# EAGLE design PCB-B4LinkMicroS (EAGLE 7.5.0)
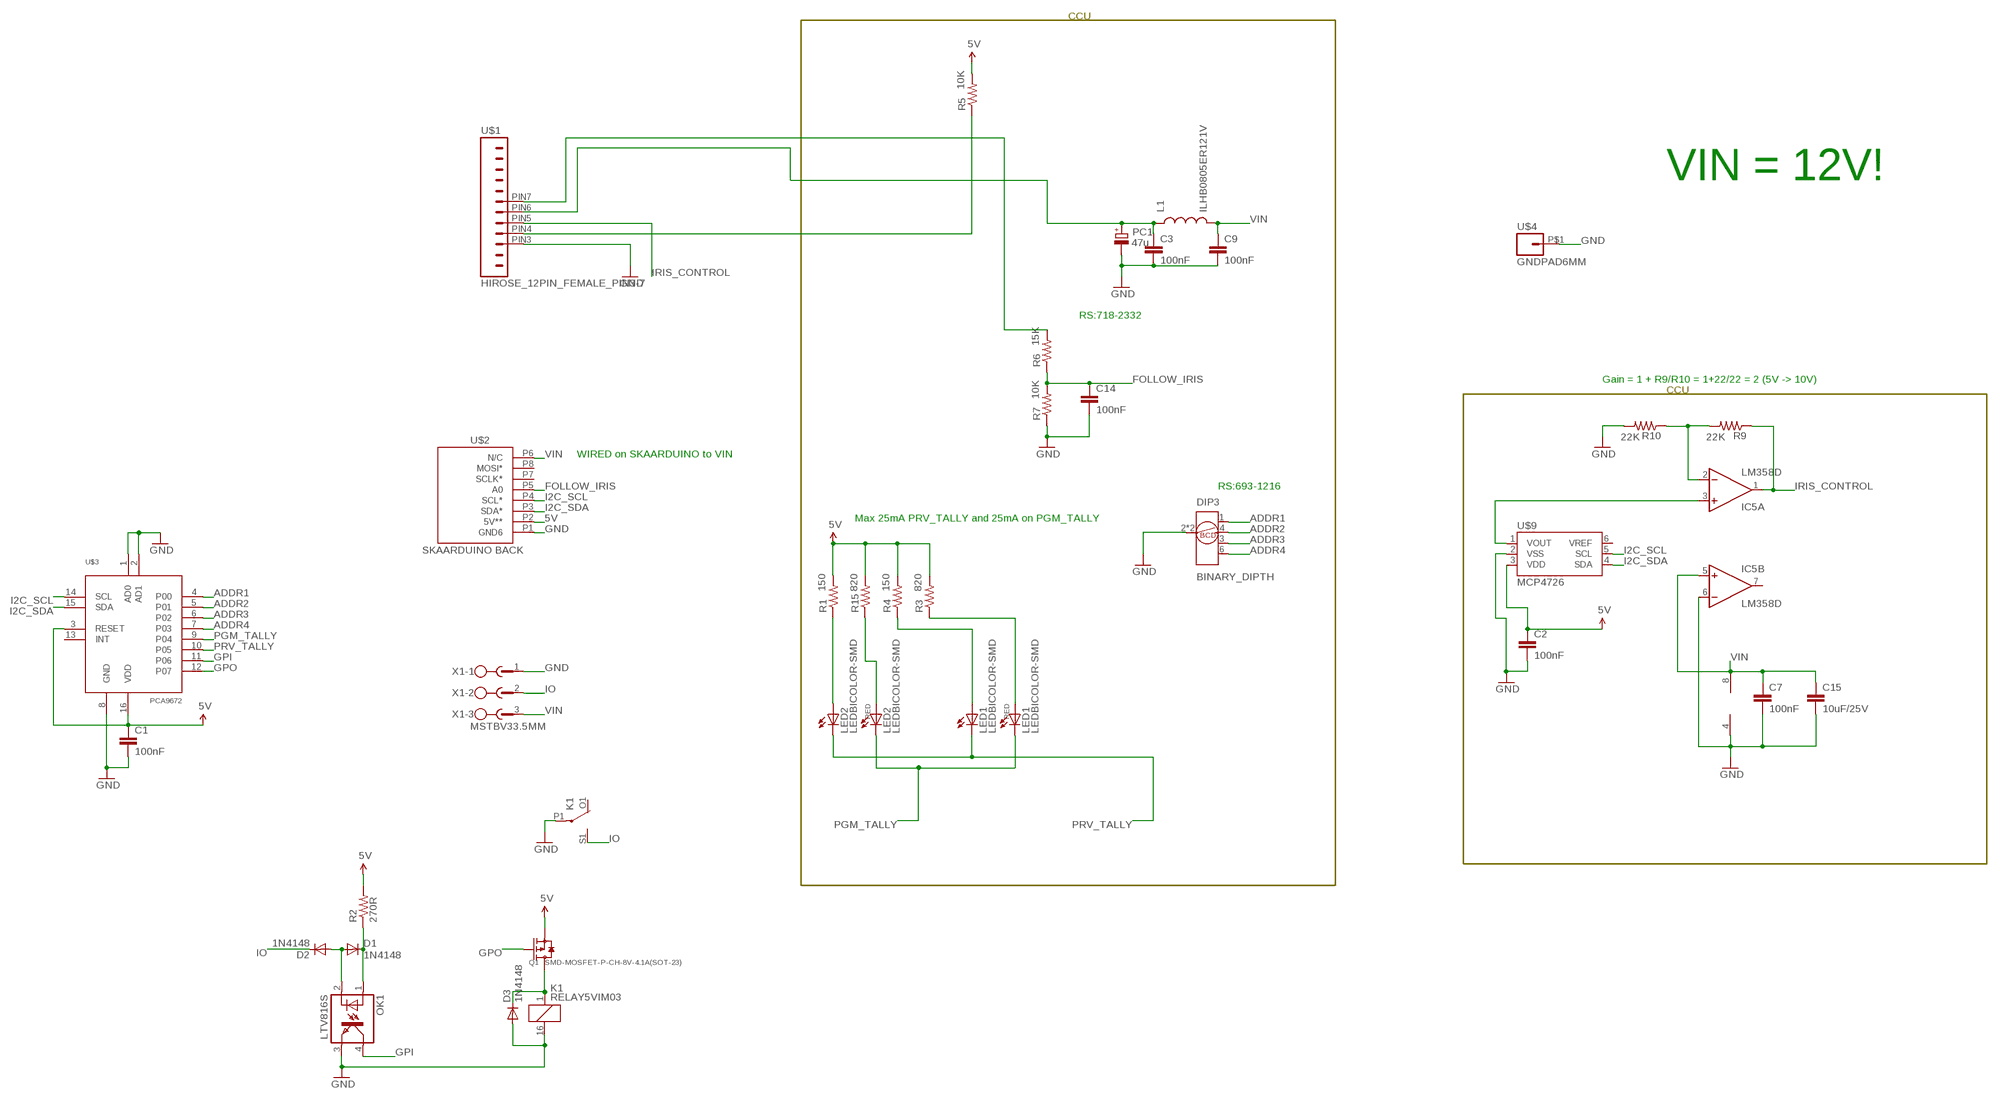
[diagram p0: schematic, sheet 1]

## Parts
C1  100nF  CAP0603-CAP  [0603-CAP]
C2  100nF  CAP0603-CAP  [0603-CAP]
C3  100nF  CAP0603-CAP  [0603-CAP]
C7  100nF  CAP0603-CAP  [0603-CAP]
C9  100nF  CAP0603-CAP  [0603-CAP]
C14  100nF  CAP0603-CAP  [0603-CAP]
C15  10uF/25V  CAP0805  [0805]
D1  1N4148  DIODESOD  [SOD-323]
D2  1N4148  DIODESOD  [SOD-323]
D3  1N4148  DIODESOD  [SOD-323]
DIP3  BINARY_DIPTH  [P65TH]
IC5  LM358D  [SO08]
K1  RELAY5VIM03  [DS2Y]
L1  ILHB0805ER121V  INDUCTOR0805  [0805]
LED1  LEDBICOLOR-SMD  [LEDBICOLOR-SMD]
LED2  LEDBICOLOR-SMD  [LEDBICOLOR-SMD]
OK1  LTV816S  [SMD4]
PC1  47u  CPOL-EUD  [PANASONIC_D]
Q1  SMD-MOSFET-P-CH-8V-4.1A(SOT-23)  [SOT-23]
R1  150  RESISTOR0603-RES  [0603-RES]
R2  270R  RESISTOR0603-RES  [0603-RES]
R3  820  RESISTOR0603-RES  [0603-RES]
R4  150  RESISTOR0603-RES  [0603-RES]
R5  10K  RESISTOR0603-RES  [0603-RES]
R6  15K  RESISTOR0603-RES  [0603-RES]
R7  10K  RESISTOR0603-RES  [0603-RES]
R9  22K  RESISTOR0603-RES  [0603-RES]
R10  22K  RESISTOR0603-RES  [0603-RES]
R15  820  RESISTOR0603-RES  [0603-RES]
U$1  HIROSE_12PIN_FEMALE_PIN3-7  [HIROSE_12PIN_RECEP_LESSHOLES]
U$2  SKAARDUINO_BACK_SERIAL  [SKAARDUINO_BACK_PTH_SERIAL]
U$3  PCA9672  [TSSOP16]
U$4  GNDPAD6MM  [3.2MMPAD6MM]
U$9  MCP4726  [SOT23-6L]
X1  MSTBV33.5MM  [MSTBV3-3.5]

## Nets
5V [power]: C1.1 C2.1 Q1.2(S) R1.2 R2.2 R3.2 R4.2 R5.2 R15.2 U$2.P2(5V**) U$3.3(RESET) U$3.16(VDD) U$9.3(VDD)
_IRIS_MANUAL: R5.1 U$1.PIN4
ADDR1: DIP3.1 U$3.4(P00)
ADDR2: DIP3.4 U$3.5(P01)
ADDR3: DIP3.3 U$3.6(P02)
ADDR4: DIP3.6 U$3.7(P03)
FOLLOW_IRIS: C14.1 R6.1 R7.2 U$2.P5(A0)
GND [power]: C1.2 C2.2 C3.2 C7.2 C9.2 C14.2 C15.2 D3.2(A) DIP3.2(GND) DIP3.5(GND) IC5.4(P:V-) IC5.6(B:-IN) K1.16 K1.P1(2:P) OK1.3(EMIT) PC1.- R7.1 R10.2 U$1.PIN3 U$2.P1(GND6) U$3.1(AD0) U$3.2(AD1) U$3.8(GND) U$4.P$1 U$9.2(VSS) X1.1
GPI: OK1.4(COL) U$3.11(P06)
GPO: Q1.1(G) U$3.12(P07)
I2C_SCL: U$2.P4(SCL*) U$3.14(SCL) U$9.5(SCL)
I2C_SDA: U$2.P3(SDA*) U$3.15(SDA) U$9.4(SDA)
IO [INput lines]: D2.1(C) K1.S1(2:S) X1.2
IRIS_CONTROL: IC5.1(A:OUT) R9.1 U$1.PIN5
N$1 [power]: C3.1 L1.1 PC1.+ U$1.PIN6
N$3: LED2.P$3(A1) R1.1
N$4: LED2.P$1(A) R15.1
N$5: D1.2(A) D2.2(A) OK1.2(C)
N$6: D1.1(C) OK1.1(A) R2.1
N$7: R6.2 U$1.PIN7
N$8: LED1.P$3(A1) R4.1
N$9: LED1.P$1(A) R3.1
N$10 [power]: D3.1(C) K1.1 Q1.3(D)
N$25: IC5.2(A:-IN) R9.2 R10.1
N$26: IC5.3(A:+IN) U$9.1(VOUT)
PGM_TALLY: LED1.P$2(C) LED2.P$2(C) U$3.9(P04)
PRV_TALLY: LED1.P$4(C1) LED2.P$4(C1) U$3.10(P05)
VIN [power]: C7.1 C9.1 C15.1 IC5.5(B:+IN) IC5.8(P:V+) L1.2 U$2.P6(N/C) X1.3
Unconnected: IC5.7(B:OUT) K1.O1(2:O) K1.O2(3:O) K1.P2(3:P) K1.S2(3:S) U$2.P7(SCLK*) U$2.P8(MOSI*) U$3.13(INT) U$9.6(VREF)

## Notes on the sheet
- CCU
- VIN = 12V!
- RS:718-2332
- Gain = 1 + R9/R10 = 1+22/22 = 2 (5V -> 10V)
- CCU
- WIRED on SKAARDUINO to VIN
- RS:693-1216
- Max 25mA PRV_TALLY and 25mA on PGM_TALLY

## Library data of the parts
C1-C3 C7 C9 C14 C15 = SparkFun:CAP: Capacitor Standard 0603 ceramic capacitor, and 0.1" leaded capacitor.
D1-D3 = SparkFun:DIODE: Diode These are standard reverse protection diodes and small signal diodes. SMA package can handle up to about 1A. SOD-323 can handle about 200mA. What the SOD-323 package when ordering, there are some mfgs out there that are 5-pin packages.
DIP3 = SKAARHOJ:BINARY_DIP
IC5 = linear:LM358: OP AMP also LM158; LM258; LM2904 Source: http://cache.national.com/ds/LM/LM158.pdf
K1 = SKAARHOJ:RELAY5V: RELAY 2 x switch, AxiCom 150 mW 5V
L1 = SparkFun:INDUCTOR: Inductors Basic Inductor/Choke - 0603 and 1206. Footprints are not proven and vary greatly between part numbers.
LED1 LED2 = SKAARHOJ:LEDBICOLOR-SMD
OK1 = optocoupler:LTV816: OPTO COUPLER Source: LITEON, LTV816.pdf; OC_FARNELL: unknown; OC_NEWARK: unknown
PC1 = rcl:CPOL-EU: POLARIZED CAPACITOR, European symbol
Q1 = Seeed-OPL-Transistor:SMD-MOSFET-P-CH-8V-4.1A(SOT-23): 305030014; MPN: CJ2305
R1-R7 R9 R10 R15 = SparkFun:RESISTOR: Resistor Basic schematic elements and footprints for 0603, 1206, and PTH resistors.
U$1 = SKAARHOJ:HIROSE_12PIN_FEMALE_PIN3-7
U$2 = SKAARHOJ:SKAARDUINO_BACK_SERIAL
U$3 = SKAARHOJ:PCA9672
U$4 = SKAARHOJ:GNDPAD
U$9 = SKAARHOJ:MCP4726
X1 = SKAARHOJ:MSTBV3: PHOENIX

## Net classes
0 default: width 0.203 mm, clearance 0.203 mm
1 power: width 0.305 mm, clearance 0.254 mm
3 INput lines: width 0.305 mm, clearance 0.254 mm

## Board
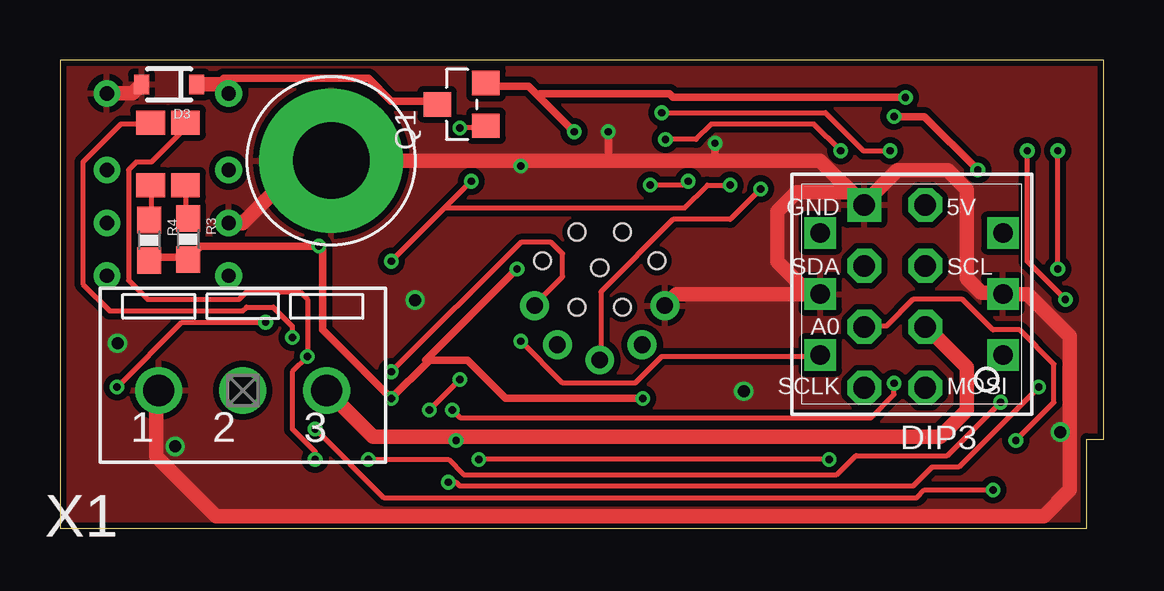
[diagram p1: board, top side]
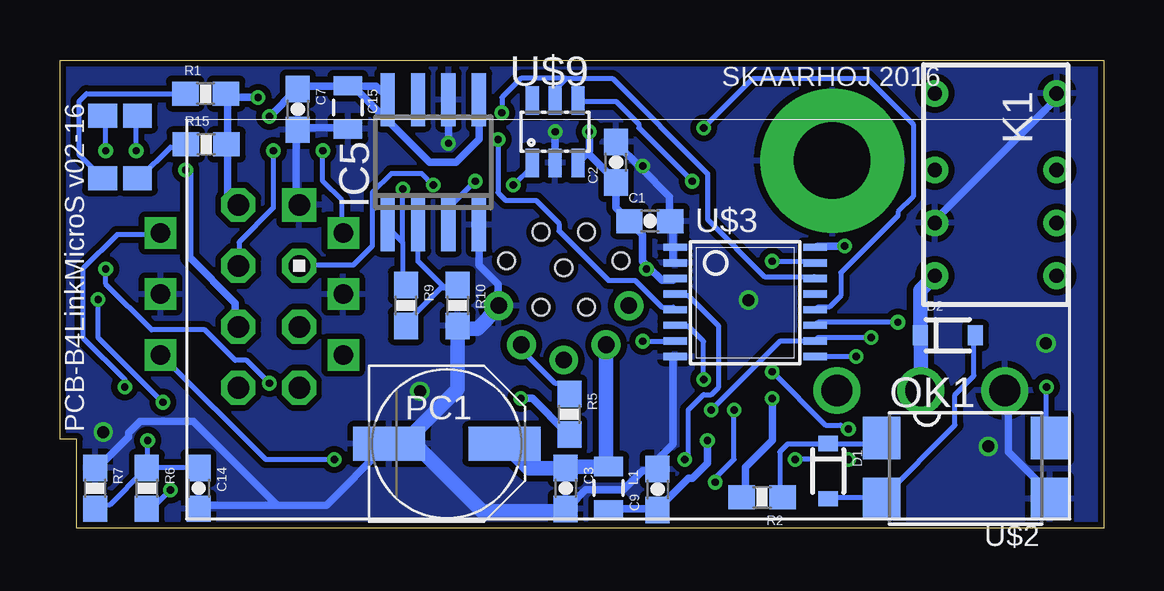
[diagram p2: board, bottom side, seen from below]

Size 43.5 x 19.5 mm. Coordinates in mm from the lower left corner, seen from the top.
Outline: 0,0 42.8,0 42.8,3.7 43.5,3.7 43.5,19.5 0,19.5 0,0
Copper layers (1*16): Top 0.035mm / dielectric 1.5mm / Bottom 0.035mm
Design rules "Fusion_eagle_rule_v1.1": minimum track width 6mil, minimum drill 12mil, track to track 6mil, track to pad 6mil, pad to pad 6mil, via to via 6mil, smd to smd 0mil, copper to edge 10mil, drill to drill 10mil, minimum pad ring 10mil, minimum via ring 6mil, stop-mask expansion 2mil, vias tented up to drill 100mil, thermal gap 10mil

### Footprints (pad centres in the part's own frame; a part is rotated, then mirrored left to right if it is on the bottom)
0603-CAP = smd 1.1 x 1: 1 -0.85,0; 2 0.85,0
0805 = smd 0.8 x 1.2: 1 -0.9,0; 2 0.9,0
SOD-323 = smd 0.63 x 0.83: 1 -1.15,0; 2 1.15,0
P65TH = drill 0.8 square: 1 -2.54,-3.81; 2 0,-3.81; 3 2.54,-3.81; 4 2.54,3.81; 5 0,3.81; 6 -2.54,3.81
SO08 = smd 0.6 x 2.2: 1 -1.905,-2.6; 2 -0.635,-2.6; 3 0.635,-2.6; 4 1.905,-2.6; 5 1.905,2.6; 6 0.635,2.6; 7 -0.635,2.6; 8 -1.905,2.6
DS2Y = drill 0.6: 1 1.2,0.46; 16 1.2,5.54; O1 4.4,0.46; O2 4.4,5.54; P1 6.6,0.46; P2 6.6,5.54; S1 8.8,0.46; S2 8.8,5.54
LEDBICOLOR-SMD = smd 1 x 1.2: P$1 1.3,0.725; P$2 -1.3,0.725; P$3 1.3,-0.725; P$4 -1.3,-0.725
SMD4 = smd 1.78 x 1.55: 1 -1.27,-3.5; 2 1.27,-3.5; 3 1.27,3.5; 4 -1.27,3.5
PANASONIC_D = smd 3 x 1.4: + 2.4,0; - -2.4,0
SOT-23 = smd 1.016 x 1.143: 1 -0.889,-1.016; 2 0.889,-1.016; 3 0,1.016
0603-RES = smd 1.1 x 1: 1 -0.85,0; 2 0.85,0
HIROSE_12PIN_RECEP_LESSHOLES = drill 0.7: PIN3 2.71,-0.48; PIN4 1.77,-2.11; PIN5 0,-2.75; PIN6 -1.77,-2.11; PIN7 -2.71,-0.48 | hole 0.7: -2.38,1.38; 2.38,1.38; -0.95,2.58; 0.95,2.58; 0,1.1; -0.95,-0.55; 0.95,-0.55
SKAARDUINO_BACK_PTH_SERIAL = drill 0.9 square: P1 13.97,32.131 | drill 0.9 octagon: P2 13.97,34.671; P3 11.43,32.131; P4 11.43,34.671; P5 8.89,32.131; P6 8.89,34.671; P7 6.35,32.131; P8 6.35,34.671
TSSOP16 = smd 0.305 x 0.991: 1 -3.575,-2.918; 2 -2.925,-2.918; 3 -2.275,-2.918; 4 -1.625,-2.918; 5 -0.975,-2.918; 6 -0.325,-2.918; 7 0.325,-2.918; 8 0.975,-2.918; 9 0.975,2.918; 10 0.325,2.918; 11 -0.325,2.918; 12 -0.975,2.918; 13 -1.625,2.918; 14 -2.275,2.918; 15 -2.925,2.918; 16 -3.575,2.918
3.2MMPAD6MM = drill 3.2 pad 6: P$1 0,0
SOT23-6L = smd 0.55 x 1.2: 1 -0.95,-1.3; 2 0,-1.3; 3 0.95,-1.3; 4 0.95,1.3; 5 0,1.3; 6 -0.95,1.3
MSTBV3-3.5 = drill 1.3: 1 -3.5,0; 2 0,0; 3 3.5,0

### Placement (x,y rotation side)
C1  18.91,12.79 0 bottom
C2  20.32,15.24 90 bottom
C3  22.43,1.65 270 bottom
C7  33.59,17.45 270 bottom
C9  18.59,1.6 90 bottom
C14  37.72,1.65 270 bottom
C15  31.5,17.53 270 bottom
D1  11.48,2.37 270 bottom
D2  6.49,8.03 0 bottom
D3  4.55,18.48 180 top
DIP3  35.5,9.75 90 top
IC5  27.94,15.24 0 bottom
K1  7.49,19.31 270 bottom
L1  20.63,1.66 270 bottom
LED1  4.5,15.59 270 top
LED2  41,15.88 270 bottom
OK1  5.75,2.48 270 bottom
PC1  27.38,3.51 0 bottom
Q1  16.74,17.65 90 top
R1  37.43,18.1 0 bottom
R2  14.23,1.28 180 bottom
R3  5.34,12.04 270 top
R4  3.72,11.99 270 top
R5  22.27,4.74 270 bottom
R6  39.88,1.65 270 bottom
R7  42.04,1.65 270 bottom
R9  29.08,9.27 270 bottom
R10  26.92,9.27 270 bottom
R15  37.41,15.98 0 bottom
U$1  22.5,9.75 0 top
U$2  1.4,-0.51 90 bottom
U$3  14.94,8.12 270 bottom
U$4  11.31,15.31 0 top
U$9  22.86,16.51 0 bottom
X1  7.62,5.73 0 top

### Tracks (layer width: path | path; a pad name or v marks a point on that pad's centre or on a via)
5V  (via drill 0.3)
  Top 0.305: v21.43,16.51 19.92,18.02 | 19.92,18.02 19.53,18.41 17.78,18.41 Q1.2 | v35.24,17.94 25.56,17.94 25.4,18.1 20,18.1 19.92,18.02 | R4.2 3.81,11.27 5.24,11.27 R3.2 5.4,11.27 5.87,11.75 v10.79,11.75 10.95,11.59 10.95,8.26 v13.81,5.4 15.32,6.91 | v24.29,5.4 18.57,5.4 16.99,6.99 15.4,6.99 15.32,6.91 | v19.05,10.79 15.24,6.99 15.32,6.91
  Bottom 0.305: U$2.P2 36.2,13.49 36.51,13.81 36.51,15.88 R15.2 36.51,16.03 36.51,17.94 R1.2 36.35,17.94 v35.24,17.94 | 18.97,10.87 19.21,11.11 19.21,12.22 19.68,12.7 C1.1 19.84,12.86 20.32,13.34 C2.1 20.32,14.45 21.51,15.64 | 18.97,10.87 18.41,10.32 17.94,10.32 U$3.3 | v21.43,16.51 21.43,15.72 21.51,15.64 | 21.51,15.64 21.91,15.24 U$9.3 | v10.79,11.75 11.91,11.75 U$3.16 | v13.81,5.4 13.81,3.65 14.92,2.54 14.92,1.43 R2.2 | v24.29,5.4 23.81,5.4 22.38,3.97 R5.2 | v19.05,10.79 18.97,10.87
_IRIS_MANUAL
  Bottom 0.203: R5.1 22.38,5.71 22.7,6.03 22.86,6.03 24.13,7.3 24.13,7.62 U$1.PIN4
ADDR1  (via drill 0.3)
  Top 0.203: v32.07,2.86 v17.46,2.86
  Bottom 0.203: v17.46,2.86 17.3,3.02 17.3,4.92 16.67,5.56 16.35,5.56 16.03,5.87 16.03,8.41 17.3,9.68 17.78,9.68 U$3.4 | v32.07,2.86 34.92,2.86 39.21,7.14 DIP3.1
ADDR2  (via drill 0.3)
  Top 0.203: v25.24,16.19 26.51,16.19 27.15,16.83 31.43,16.83 v32.54,15.72
  Bottom 0.203: v25.24,16.19 25.24,13.97 24.92,13.65 23.65,13.65 22.7,12.7 22.7,12.38 20.64,10.32 19.53,10.32 18.41,9.21 17.94,9.21 U$3.5 | v32.54,15.72 32.54,14.45 31.75,13.65 31.75,12.38 DIP3.4
ADDR3  (via drill 0.3)
  Top 0.203: v15.4,4.92 v16.67,6.19 | v16.19,1.91 16.51,1.91 16.67,1.75 35.56,1.75 36.35,2.54 37.47,2.54 v40.8,5.87
  Bottom 0.203: v16.67,6.19 16.67,7.78 17.3,8.41 17.78,8.41 U$3.6 | v15.4,4.92 15.4,2.86 16.19,2.06 v16.19,1.91 | v40.8,5.87 40.8,6.19 42.55,7.94 42.55,10.79 41.12,12.22 39.37,12.22 DIP3.3
ADDR4  (via drill 0.3)
  Top 0.203: v19.21,7.78 20.95,6.03 23.97,6.03 25.08,7.14 31.59,7.14 DIP3.6
  Bottom 0.203: v19.21,7.78 17.94,7.78 U$3.7
FOLLOW_IRIS  (via drill 0.3)
  Top 0.203: v39.85,3.65 41.43,5.24 41.43,6.83 40.01,8.26 38.89,8.26 37.62,9.53 35.56,9.53 34.45,8.41 33.66,8.41 U$2.P5
  Bottom 0.203: 39.85,2.54 37.78,2.54 C14.1 | R7.2 41.91,0.95 41.43,0.95 40.01,2.38 R6.1 39.85,2.54 | 39.85,2.54 v39.85,3.65
GND  (via drill 0.3, 0.5)
  Top 0.305: 22.86,15.31 v22.86,16.51 | 27.3,15.31 v27.3,16.03 | v19.21,15.08 19.21,15.31
  Top 0.61: U$2.P1 33.53,13.53 34.9,14.9 37,14.9 37.8,14.1 37.8,10.4 38.4,9.8 39.26,9.8 DIP3.2 40.35,9.75 42.1,8 42.1,1.6 41,0.5 6.5,0.5 4,3 4,5.61 X1.1 | K1.P1 7.62,12.7 10.23,15.31 U$4.P$1 19.21,15.31 22.86,15.31 27.3,15.31 31.68,15.31 U$2.P1 | K1.16 3.03,18.11 D3.2 | U$1.PIN3 25.69,9.75 DIP3.5 31.25,9.75 29.9,11.1 29.9,13.2 30.7,14 32.99,14 U$2.P1
  Bottom 0.305: U$3.2 17.94,11.11 17.94,11.59 U$3.1 17.94,11.75 17.94,12.7 C1.2 18.1,12.86 18.1,13.81 19.29,15 | 19.29,15 20.32,16.03 C2.2 | U$3.8 17.94,7.14 17.94,3.49 18.57,2.86 18.57,2.54 C9.2 18.73,2.38 19.21,2.38 20,1.59 21.59,1.59 22.23,0.95 C3.2 | C15.2 31.59,16.67 33.5,16.67 C7.2 33.66,16.51 33.66,13.49 U$2.P1 | 34.45,0.95 32.38,0.95 30,3.33 PC1.- | 34.45,0.95 37.62,0.95 C14.2 | 34.45,0.95 37.94,4.45 40.16,4.45 40.64,3.97 40.64,3.81 41.91,2.54 R7.1 | v22.86,16.51 U$9.2 | OK1.3 2.38,1.27 2.38,1.59 3.97,3.17 3.97,5.71 X1.1 | IC5.4 26.04,10.95 25.24,10.16 25.24,9.53 U$1.PIN3 | v27.3,16.03 IC5.6 | K1.16 2.06,18.1 2.06,17.78 6.99,12.86 K1.P1 | v19.21,15.08 19.29,15
  Bottom 0.61: PC1.- 29.2,3.51 | 29.2,3.51 28.71,3.51 25.9,0.7 22.52,0.7 C3.2 | U$1.PIN3 25.21,9.19 26.1,8.3 26.8,8.3 R10.2 26.92,5.79 29.2,3.51
  other vias: 28.5,5.7 41.7,4 14.8,9.5 4.8,3.4 2.4,7.7
  pour Bottom: 0,0 43.8,0 43.8,19.6 0,19.6
  pour Top: 0,0 43.8,0 43.8,19.6 0,19.6
GPI  (via drill 0.3)
  Top 0.203: v8.57,8.57 5.08,8.57 v2.38,5.87
  Bottom 0.203: v8.57,8.57 11.91,8.57 U$3.11 | v2.38,5.87 2.38,3.81 OK1.4
GPO  (via drill 0.3)
  Top 0.203: v16.67,16.67 17.62,16.67 Q1.1
  Bottom 0.203: v16.67,16.67 14.61,18.73 9.84,18.73 7.94,16.83 7.94,13.81 8.57,13.18 8.57,13.02 10.95,10.64 10.95,9.68 11.43,9.21 11.91,9.21 U$3.12
I2C_SCL  (via drill 0.3)
  Top 0.203: v34.61,15.72 33.5,15.72 31.91,17.3 v25.08,17.3
  Bottom 0.203: 22.38,18.73 20.48,18.73 16.51,14.76 16.51,12.86 14.13,10.48 12.06,10.48 U$3.14 | 22.38,18.73 22.86,18.26 U$9.5 | v34.61,15.72 34.61,13.34 36.04,11.91 36.04,10.95 U$2.P4 | v25.08,17.3 25.08,17.94 24.29,18.73 22.38,18.73
I2C_SDA  (via drill 0.3)
  Top 0.203: v17.14,14.45 16.03,13.34 | 16.03,13.34 v13.81,11.11 | v27.94,14.29 26.99,14.29 26.04,13.34 16.03,13.34
  Bottom 0.203: v13.81,11.11 12.06,11.11 U$3.15 | v17.14,14.45 19.37,16.67 19.37,16.83 20.32,17.78 21.91,17.78 U$9.4 | v27.94,14.29 28.42,14.76 29.69,14.76 30.48,13.97 30.48,11.75 31.27,10.95 33.5,10.95 U$2.P3
IO
  Bottom 0.61: K1.S1 7.64,9.9 D2.1 7.62,8.01 X1.2
IRIS_CONTROL  (via drill 0.3)
  Top 0.203: v29.21,14.13 27.94,12.86 25.56,12.86 22.54,9.84 22.54,7.14 U$1.PIN5
  Bottom 0.203: 29.21,11.91 29.21,10.16 R9.1 | 29.21,11.91 29.84,12.54 IC5.1 | 29.21,11.91 v29.21,14.13
N$1
  Bottom 0.61: U$1.PIN6 20.73,2.66 L1.1 22.36,2.56 C3.1 23.96,2.5 PC1.+
N$3
  Bottom 0.203: R1.1 38.42,18.1 42.39,18.1 42.7,17.78 42.7,15.56 41.75,14.61 LED2.P$3
N$4
  Bottom 0.203: R15.1 38.26,15.88 38.89,15.88 40.16,14.61 LED2.P$1
N$5
  Bottom 0.203: D1.2 11.43,1.27 9.37,1.27 OK1.2 9.21,1.27 6.19,4.29 6.19,5.56 5.4,6.35 5.4,7.94 D2.2
N$6
  Bottom 0.203: OK1.1 9.37,3.65 9.53,3.49 11.43,3.49 D1.1 11.59,3.49 13.18,3.49 13.49,3.17 13.49,1.43 R2.1
N$7  (via drill 0.3)
  Top 0.203: v38.89,1.59 36.04,1.59 35.72,1.27 13.49,1.27 v10.64,4.13 | v13.81,6.51 19.21,11.91 20.48,11.91 20.95,11.43 20.95,10.48 19.84,9.37 U$1.PIN7
  Bottom 0.203: v38.89,1.59 39.53,0.95 39.85,0.95 R6.2 | v10.64,4.13 10.79,4.13 10.95,4.29 11.59,4.29 v13.81,6.51
N$8
  Top 0.203: R4.1 3.81,12.86 3.81,14.29 LED1.P$3
N$9
  Top 0.203: R3.1 5.24,13.02 5.24,14.29 LED1.P$1
N$10
  Top 0.305: Q1.3 15.72,17.78 13.81,17.78 12.86,18.73 6.83,18.73 6.66,18.48
  Top 0.61: D3.1 6.66,18.48 K1.1
N$25
  Bottom 0.203: 27.46,10 27.62,10 29.05,8.57 R9.2 | 27.46,10 26.99,10 R10.1 | IC5.2 28.57,11.11 27.46,10
N$26  (via drill 0.3)
  Top 0.203: v24.61,14.29 26.04,14.29 v26.19,14.45
  Bottom 0.203: v24.61,14.29 23.81,15.08 U$9.1 | v26.19,14.45 27.3,13.34 IC5.3
PGM_TALLY  (via drill 0.3)
  Top 0.203: LED1.P$2 5.08,16.83 5.08,16.51 3.81,15.24 3.17,15.24 2.86,14.92 2.86,10.32 3.65,9.53 7.46,9.53 7.78,9.84 10,9.84 10.32,9.53 v10.32,7.14 9.68,6.51 9.68,4.13 10.64,3.17 v10.64,2.86 | v40.32,15.72 40.32,11.11 v41.91,9.53 | v39.21,5.24 36.99,3.02 33.18,3.02 32.38,2.22 16.83,2.22 16.19,2.86 v12.86,2.86
  Bottom 0.203: v10.32,7.14 11.91,7.14 U$3.9 | v40.32,15.72 40.32,17.14 LED2.P$2 | v41.91,9.53 41.91,7.94 v39.21,5.24 | v10.64,2.86 v12.86,2.86
PRV_TALLY  (via drill 0.3)
  Top 0.203: v9.68,7.94 9.68,8.41 8.89,9.21 7.78,9.21 7.62,9.05 2.06,9.05 0.95,10.16 0.95,15.24 2.54,16.83 3.65,16.83 LED1.P$4 | v41.59,10.79 v41.59,15.72 | v34.77,6.03 34.77,5.56 33.81,4.6 16.67,4.6 v16.35,4.92
  Bottom 0.203: v9.68,7.94 11.91,7.94 U$3.10 12.06,7.78 13.49,7.78 v16.35,4.92 | v41.59,15.72 41.59,17.14 LED2.P$4 | v41.59,10.79 41.59,10.16 39.69,8.26 37.47,8.26 36.2,6.99 35.72,6.99 v34.77,6.03
VIN  (via drill 0.3)
  Top 0.305: v16.51,3.65 16.51,3.8 | v38.26,14.92 36.04,17.14 v34.77,17.14
  Top 0.61: U$2.P6 36.12,8.38 37.8,6.7 37.8,4.9 36.7,3.8 16.51,3.8 13.05,3.8 X1.3
  Bottom 0.305: L1.2 20.48,0.79 18.73,0.79 C9.1 18.57,0.79 17.3,2.06 17.14,2.06 16.51,2.7 v16.51,3.65 | C15.1 31.59,18.41 33.5,18.41 C7.1 33.66,18.26 v34.77,17.14 | 31.27,18.41 30.32,18.41 29.84,17.94 IC5.8 | 31.27,18.41 31.43,18.41 C15.1 | IC5.5 26.04,16.19 26.99,15.24 28.1,15.24 31.27,18.41 | 31.27,18.41 C15.1 | v38.26,14.92 38.1,14.76 38.1,11.27 36.2,9.37 36.2,8.41 U$2.P6

### Text on the board
_bsilk: SKAARHOJ 2016 | PCB-B4LinkMicroS v02-16